# Altium schematic sheet Power.SchDoc
size A
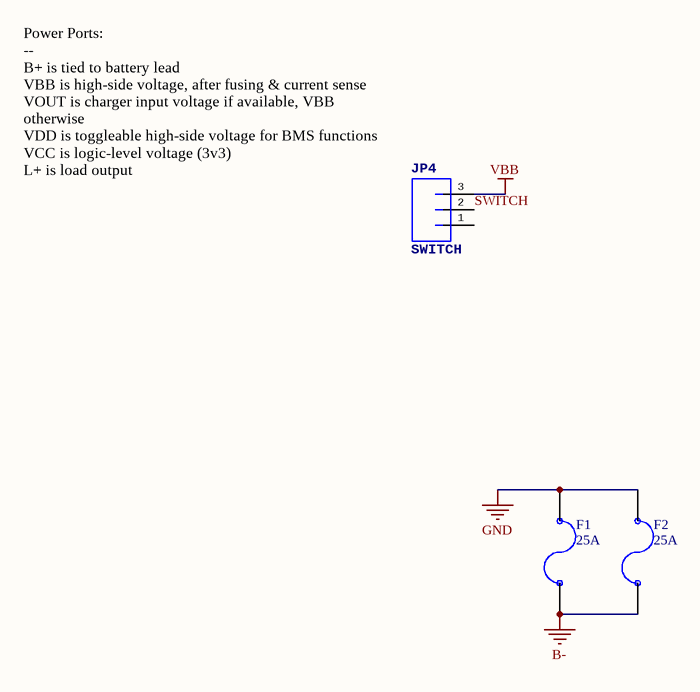
[diagram p0: Power.SchDoc]

## Parts
F1  25A  [1206_FUSE]
F2  25A  [1206_FUSE]
JP4  SWITCH  [JST-3-PTH-VERT]

## Nets
B-: F1.2 F2.2
GND: F1.1 F2.1
VBB: JP4.3
SWITCH: JP4.2

Not connected (* = marked no-connect by the designer): JP4 1

## Notes on the sheet
- (near JP4) Power Ports:
  --
  B+ is tied to battery lead
  VBB is high-side voltage, after fusing & current sense
  VOUT is charger input voltage if available, VBB otherwise
  VDD is toggleable high-side voltage for BMS functions
  VCC is logic-level voltage (3v3)
  L+ is load output

## Library data of the parts
F1 F2 = FUSE 1206: Fuse; Supplier 1: Allied; Supplier Part Number 1: 70160157
JP4 = JST_3